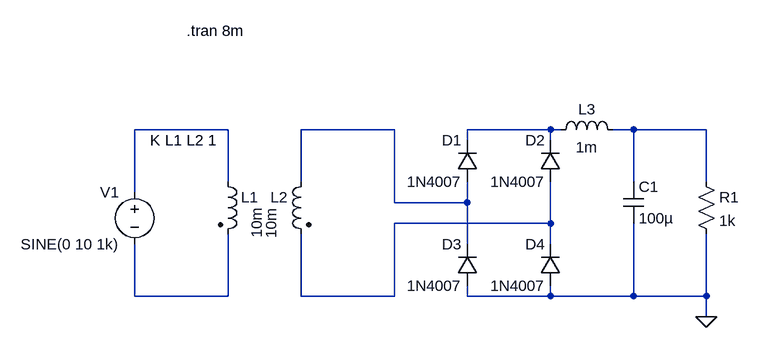
[diagram p0: schematic Bridge Rectifer with LC filter.asc]
Bridge Rectifer with LC filter.asc, the LTspice schematic file:
Version 4
SHEET 1 968 680
WIRE 32 -112 -112 -112
WIRE 288 -112 144 -112
WIRE 528 -112 400 -112
WIRE 544 -112 528 -112
WIRE 656 -112 624 -112
WIRE 768 -112 656 -112
WIRE 400 -96 400 -112
WIRE 528 -96 528 -112
WIRE 32 -32 32 -112
WIRE 144 -32 144 -112
WIRE 656 -32 656 -112
WIRE 768 -32 768 -112
WIRE -112 -16 -112 -112
WIRE 288 0 288 -112
WIRE 400 0 400 -32
WIRE 400 0 288 0
WIRE 528 32 528 -32
WIRE 528 32 288 32
WIRE 400 64 400 0
WIRE 528 64 528 32
WIRE -112 144 -112 64
WIRE 32 144 32 48
WIRE 32 144 -112 144
WIRE 144 144 144 48
WIRE 288 144 288 32
WIRE 288 144 144 144
WIRE 400 144 400 128
WIRE 528 144 528 128
WIRE 528 144 400 144
WIRE 656 144 656 32
WIRE 656 144 528 144
WIRE 768 144 768 48
WIRE 768 144 656 144
WIRE 768 176 768 144
FLAG 768 176 0
SYMBOL voltage -112 -32 M0
WINDOW 123 0 0 Left 0
WINDOW 39 0 0 Left 0
SYMATTR InstName V1
SYMATTR Value SINE(0 10 1k)
SYMBOL ind2 16 -48 R0
WINDOW 3 60 55 VRight 2
SYMATTR Value 10m
SYMATTR InstName L1
SYMATTR Type ind
SYMATTR SpiceLine Rser=1
SYMBOL ind2 160 -48 M0
WINDOW 3 62 80 VCenter 2
SYMATTR Value 10m
SYMATTR InstName L2
SYMATTR Type ind
SYMATTR SpiceLine Rser=1
SYMBOL diode 416 -32 R180
WINDOW 0 24 64 Left 2
WINDOW 3 24 0 Left 2
SYMATTR InstName D1
SYMATTR Value 1N4007
SYMBOL diode 544 -32 R180
WINDOW 0 24 64 Left 2
WINDOW 3 24 0 Left 2
SYMATTR InstName D2
SYMATTR Value 1N4007
SYMBOL diode 416 128 R180
WINDOW 0 24 64 Left 2
WINDOW 3 24 0 Left 2
SYMATTR InstName D3
SYMATTR Value 1N4007
SYMBOL diode 544 128 R180
WINDOW 0 24 64 Left 2
WINDOW 3 24 0 Left 2
SYMATTR InstName D4
SYMATTR Value 1N4007
SYMBOL cap 640 -32 R0
SYMATTR InstName C1
SYMATTR Value 100µ
SYMBOL ind 528 -96 R270
WINDOW 0 32 56 VTop 2
WINDOW 3 5 56 VBottom 2
SYMATTR InstName L3
SYMATTR Value 1m
SYMBOL res 752 -48 R0
SYMATTR InstName R1
SYMATTR Value 1k
TEXT -88 -96 Left 2 !K L1 L2 1
TEXT -32 -264 Left 2 !.tran 8m

The netlist it stands for:
* Bridge Rectifer with LC filter.asc
V1 N001 N006 SINE(0 10 1k)
L1 N001 N006 10m Rser=1
L2 N002 N005 10m Rser=1
D1 N002 N003 1N4007
D2 N005 N003 1N4007
D3 0 N002 1N4007
D4 0 N005 1N4007
C1 N004 0 100µ
L3 N003 N004 1m
R1 N004 0 1k
.model D D
.lib standard.dio
K L1 L2 1
.tran 8m
.backanno
.end